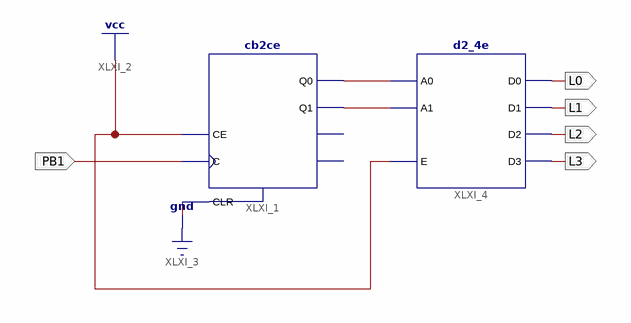
[diagram p0: schematic sheet 1]
// Xilinx ISE schematic counter2bit.sch (spartan6) as structural Verilog: 2 symbols, 5 ports
module counter2bit (
  input  PB1,
  output L0,
  output L1,
  output L2,
  output L3
);

  wire XLXN_4, XLXN_5;

  cb2ce XLXI_1 (.C(PB1), .CE(1'b1), .CLR(1'b0), .Q0(XLXN_4), .Q1(XLXN_5));  // open: CEO, TC
  d2_4e XLXI_4 (.A0(XLXN_4), .A1(XLXN_5), .E(1'b1), .D0(L0), .D1(L1), .D2(L2), .D3(L3));
endmodule
